# Altium schematic sheet MidLevel.SchDoc
size Letter
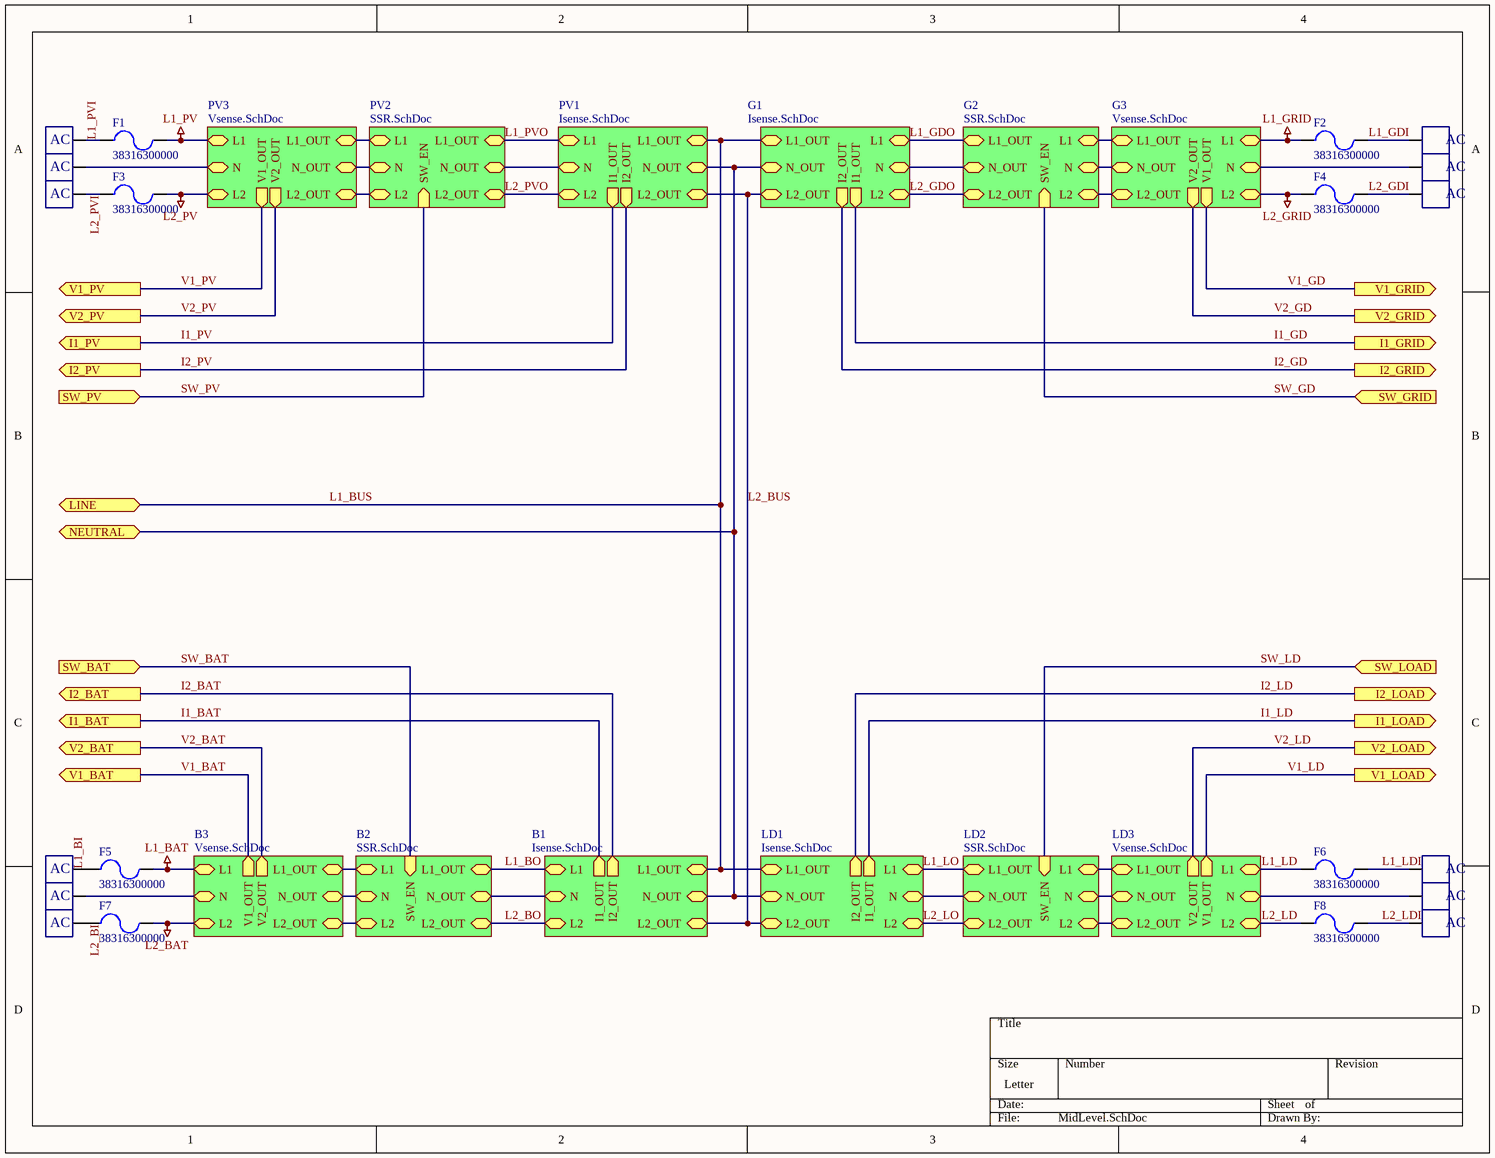
[diagram p0: MidLevel.SchDoc]

## Parts
F1  38316300000  [38316300000]
F2  38316300000  [38316300000]
F3  38316300000  [38316300000]
F4  38316300000  [38316300000]
F5  38316300000  [38316300000]
F6  38316300000  [38316300000]
F7  38316300000  [38316300000]
F8  38316300000  [38316300000]
J2  AC Connector_1  [AC_Connector_1]  (value not drawn)
J3  AC Connector_1  [AC_Connector_1]  (value not drawn)
J4  AC Connector_1  [AC_Connector_1]  (value not drawn)
J5  AC Connector_1  [AC_Connector_1]  (value not drawn)
J6  AC Connector_1  [AC_Connector_1]  (value not drawn)
J7  AC Connector_1  [AC_Connector_1]  (value not drawn)
J8  AC Connector_1  [AC_Connector_1]  (value not drawn)
J9  AC Connector_1  [AC_Connector_1]  (value not drawn)
J10  AC Connector_1  [AC_Connector_1]  (value not drawn)
J11  AC Connector_1  [AC_Connector_1]  (value not drawn)
J12  AC Connector_1  [AC_Connector_1]  (value not drawn)
J13  AC Connector_1  [AC_Connector_1]  (value not drawn)

## Sub-sheets
B1 = Isense.SchDoc: L1_OUT (bidir), L2_OUT (bidir), N_OUT (bidir), I1_OUT (out), I2_OUT (out), L1 (bidir), N (bidir), L2 (bidir)
B2 = SSR.SchDoc: SW_EN (in), L2_OUT (bidir), L2 (bidir), L1 (bidir), L1_OUT (bidir), N_OUT (bidir), N (bidir)
B3 = Vsense.SchDoc: L1 (bidir), L1_OUT (bidir), N (bidir), L2 (bidir), L2_OUT (bidir), N_OUT (bidir), V1_OUT (out), V2_OUT (out)
G1 = Isense.SchDoc: L1_OUT (bidir), L2_OUT (bidir), N_OUT (bidir), I1_OUT (out), I2_OUT (out), L1 (bidir), N (bidir), L2 (bidir)
G2 = SSR.SchDoc: SW_EN (in), N_OUT (bidir), L1_OUT (bidir), L2 (bidir), N (bidir), L1 (bidir), L2_OUT (bidir)
G3 = Vsense.SchDoc: L1 (bidir), L1_OUT (bidir), N (bidir), L2 (bidir), L2_OUT (bidir), N_OUT (bidir), V1_OUT (out), V2_OUT (out)
LD1 = Isense.SchDoc: L1_OUT (bidir), L2_OUT (bidir), N_OUT (bidir), I1_OUT (out), I2_OUT (out), L1 (bidir), N (bidir), L2 (bidir)
LD2 = SSR.SchDoc: SW_EN (in), L1_OUT (bidir), L2 (bidir), L2_OUT (bidir), L1 (bidir), N (bidir), N_OUT (bidir)
LD3 = Vsense.SchDoc: L1 (bidir), L1_OUT (bidir), N (bidir), L2 (bidir), L2_OUT (bidir), N_OUT (bidir), V1_OUT (out), V2_OUT (out)
PV1 = Isense.SchDoc: L1_OUT (bidir), L2_OUT (bidir), N_OUT (bidir), I1_OUT (out), I2_OUT (out), L1 (bidir), N (bidir), L2 (bidir)
PV2 = SSR.SchDoc: SW_EN (in), L2_OUT (bidir), N (bidir), N_OUT (bidir), L1 (bidir), L1_OUT (bidir), L2 (bidir)
PV3 = Vsense.SchDoc: L1 (bidir), L1_OUT (bidir), N (bidir), L2 (bidir), L2_OUT (bidir), N_OUT (bidir), V1_OUT (out), V2_OUT (out)

## Ports
I1_BAT (out), I1_GRID (out), I1_LOAD (out), I1_PV (out), I2_BAT (out), I2_GRID (out), I2_LOAD (out), I2_PV (out), LINE (bidir), NEUTRAL (bidir), SW_BAT (in), SW_GRID (in), SW_LOAD (in), SW_PV (in), V1_BAT (out), V1_GRID (out), V1_LOAD (out), V1_PV (out), V2_BAT (out), V2_GRID (out), V2_LOAD (out), V2_PV (out)

## Nets
L1_BAT: F5.2 ; sheet B3/L1
L1_GRID: F2.1 ; sheet G3/L1
L1_PV: F1.2 ; sheet PV3/L1
L2_BAT: F7.2 ; sheet B3/L2
L2_GRID: F4.1 ; sheet G3/L2
L2_PV: F3.2 ; sheet PV3/L2
I1_BAT: port I1_BAT, sheet B1/I1_OUT
I1_GD: port I1_GRID, sheet G1/I1_OUT
I1_LD: port I1_LOAD, sheet LD1/I1_OUT
I1_PV: port I1_PV, sheet PV1/I1_OUT
I2_BAT: port I2_BAT, sheet B1/I2_OUT
I2_GD: port I2_GRID, sheet G1/I2_OUT
I2_LD: port I2_LOAD, sheet LD1/I2_OUT
I2_PV: port I2_PV, sheet PV1/I2_OUT
L1_BI: F5.1 J8.1
L1_BO: sheet B1/L1, sheet B2/L1_OUT
L1_BUS: port LINE, sheet PV1/L1_OUT, sheet B1/L1_OUT, sheet LD1/L1_OUT, sheet G1/L1_OUT
L1_GDI: F2.2 J3.1
L1_GDO: sheet G1/L1, sheet G2/L1_OUT
L1_LD: F6.1 ; sheet LD3/L1
L1_LDI: F6.2 J9.1
L1_LO: sheet LD1/L1, sheet LD2/L1_OUT
L1_PVI: F1.1 J2.1
L1_PVO: sheet PV1/L1, sheet PV2/L1_OUT
L2_BI: F7.1 J12.1
L2_BO: sheet B1/L2, sheet B2/L2_OUT
L2_BUS: sheet PV1/L2_OUT, sheet B1/L2_OUT, sheet LD1/L2_OUT, sheet G1/L2_OUT
L2_GDI: F4.2 J7.1
L2_GDO: sheet G1/L2, sheet G2/L2_OUT
L2_LD: F8.1 ; sheet LD3/L2
L2_LDI: F8.2 J13.1
L2_LO: sheet LD1/L2, sheet LD2/L2_OUT
L2_PVI: F3.1 J6.1
L2_PVO: sheet PV1/L2, sheet PV2/L2_OUT
NEUTRAL: port NEUTRAL, sheet PV1/N_OUT, sheet B1/N_OUT, sheet LD1/N_OUT, sheet G1/N_OUT
SW_BAT: port SW_BAT, sheet B2/SW_EN
SW_GD: port SW_GRID, sheet G2/SW_EN
SW_LD: port SW_LOAD, sheet LD2/SW_EN
SW_PV: port SW_PV, sheet PV2/SW_EN
V1_BAT: port V1_BAT, sheet B3/V1_OUT
V1_GD: port V1_GRID, sheet G3/V1_OUT
V1_LD: port V1_LOAD, sheet LD3/V1_OUT
V1_PV: port V1_PV, sheet PV3/V1_OUT
V2_BAT: port V2_BAT, sheet B3/V2_OUT
V2_GD: port V2_GRID, sheet G3/V2_OUT
V2_LD: port V2_LOAD, sheet LD3/V2_OUT
V2_PV: port V2_PV, sheet PV3/V2_OUT
NetJ4_1: J4.1 ; sheet PV3/N
NetJ5_1: J5.1 ; sheet G3/N
NetJ10_1: J10.1 ; sheet B3/N
NetJ11_1: J11.1 ; sheet LD3/N
(unnamed): sheet PV1/N, sheet PV2/N_OUT
(unnamed): sheet B1/N, sheet B2/N_OUT
(unnamed): sheet LD1/N, sheet LD2/N_OUT
(unnamed): sheet G1/N, sheet G2/N_OUT
(unnamed): sheet LD2/L2, sheet LD3/L2_OUT
(unnamed): sheet LD2/L1, sheet LD3/L1_OUT
(unnamed): sheet LD2/N, sheet LD3/N_OUT
(unnamed): sheet PV2/N, sheet PV3/N_OUT
(unnamed): sheet PV2/L1, sheet PV3/L1_OUT
(unnamed): sheet PV2/L2, sheet PV3/L2_OUT
(unnamed): sheet B2/L2, sheet B3/L2_OUT
(unnamed): sheet B2/L1, sheet B3/L1_OUT
(unnamed): sheet B2/N, sheet B3/N_OUT
(unnamed): sheet G2/L2, sheet G3/L2_OUT
(unnamed): sheet G2/N, sheet G3/N_OUT
(unnamed): sheet G2/L1, sheet G3/L1_OUT

## Notes on the sheet
- (in symbol AC Connector_1) AC

## Library data of the parts
F1-F8 = 38316300000: FUSE BOARD MOUNT 6.3A 300VAC RAD; Manufacturer: Littelfuse Inc.; Manufacturer Part Number: 38316300000; Supplier 1: Digi-Key; Supplier Part Number 1: WK6301CT-ND
J2-J13 = AC Connector_1: AC Connector